# EAGLE schematic maplemini-r2 (EAGLE 5.10)
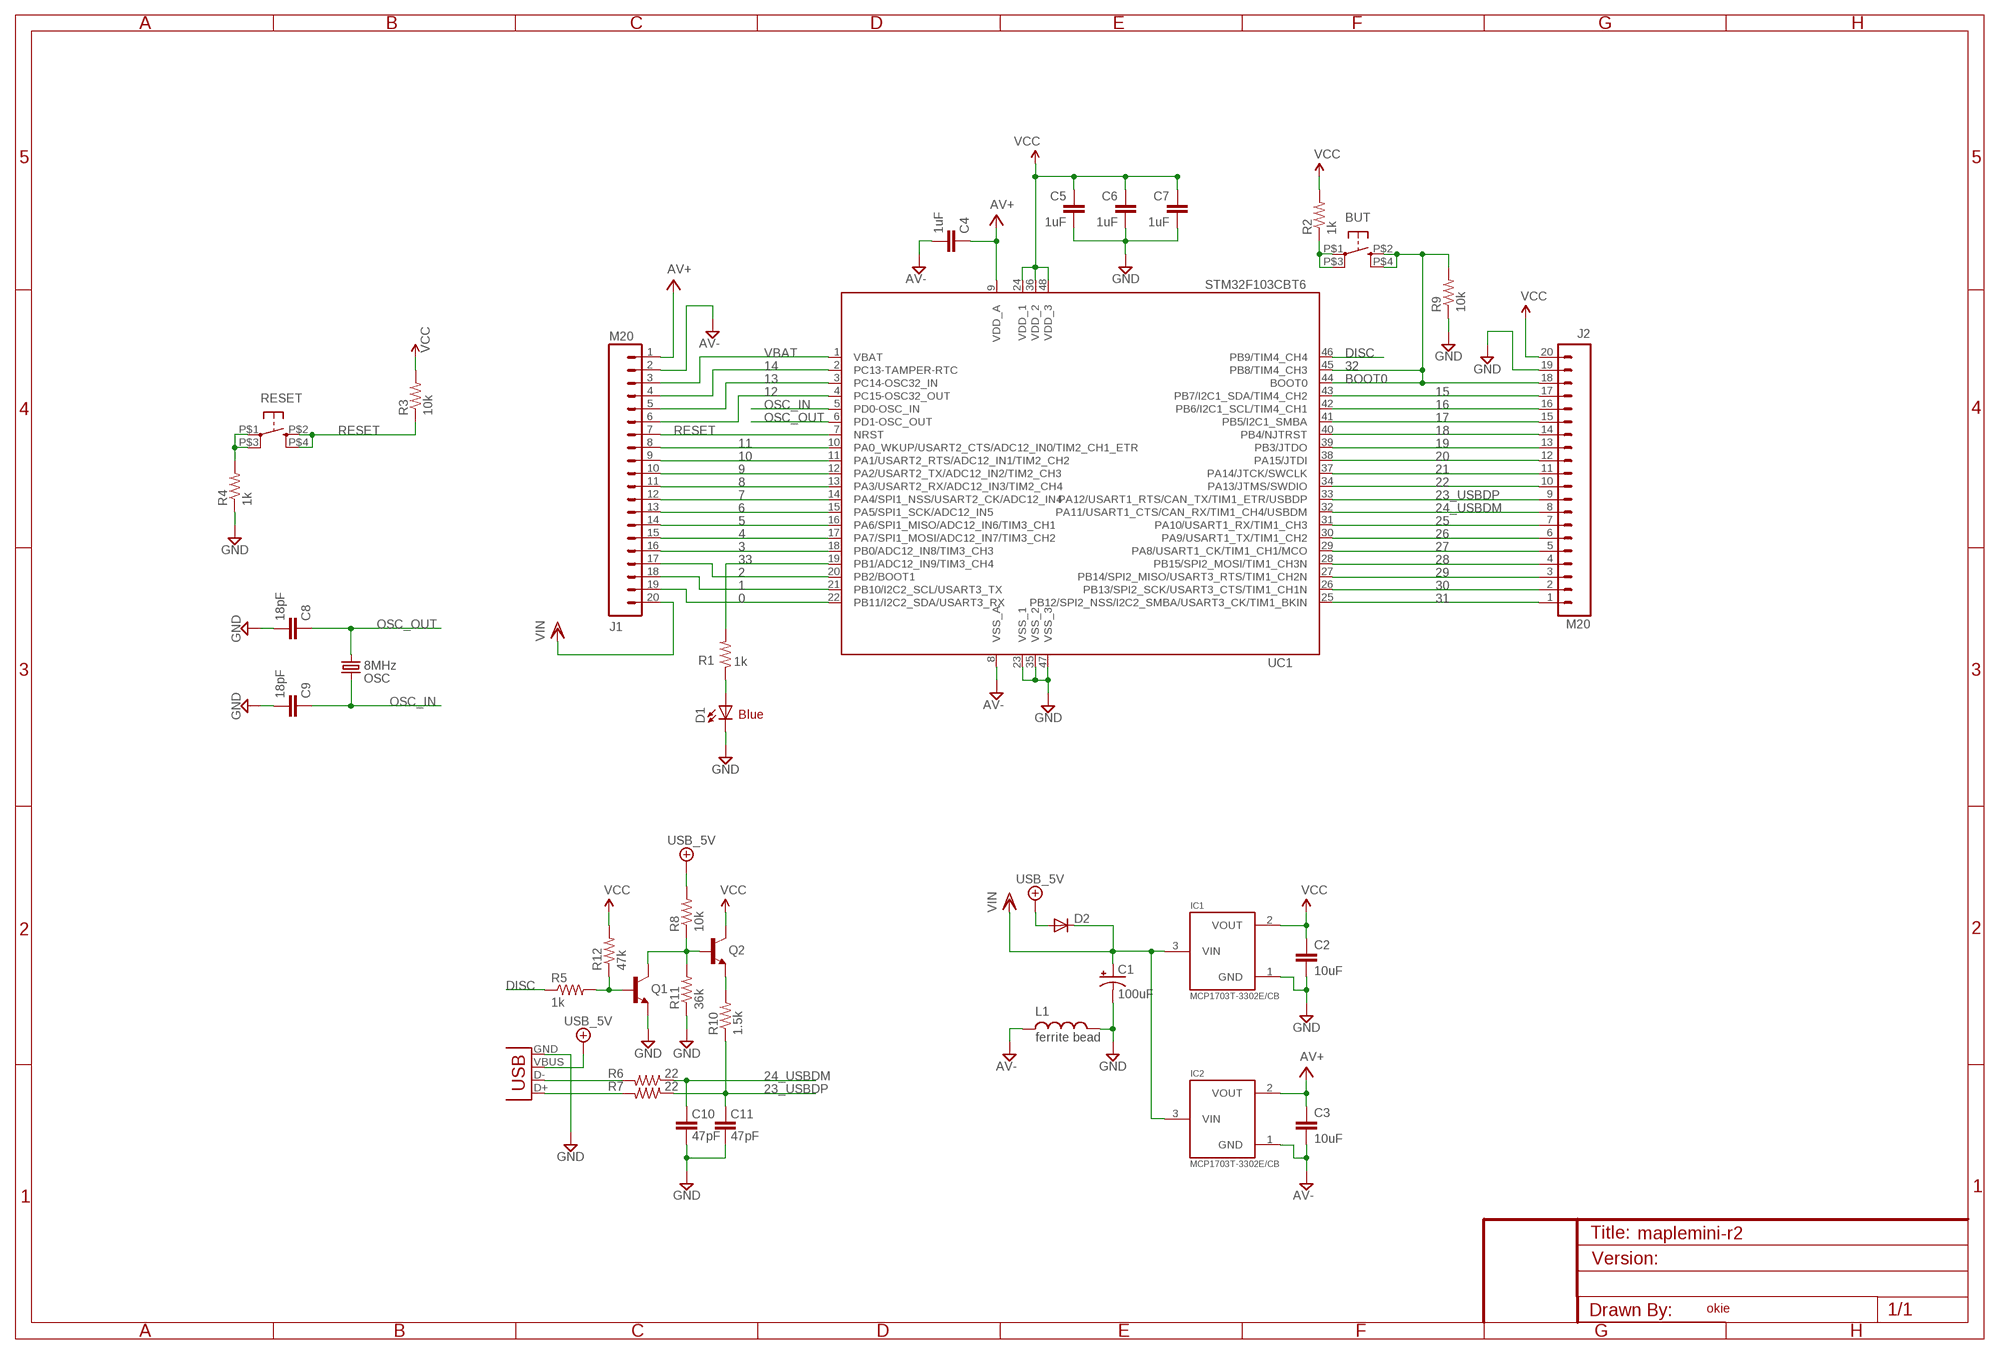
[diagram p0: schematic, sheet 1]

## Parts
BUT  KMR211GLFS  BUTTON-KMR241GLFS  [PUSHBUTTON-KMR241GLFS]
C1  100uF  CAP_POL1206  [EIA3216]
C2  10uF  CAP0805  [0805]
C3  10uF  CAP0805  [0805]
C4  1uF  CAP0402  [C0402]
C5  1uF  CAP0402  [C0402]
C6  1uF  CAP0402  [C0402]
C7  1uF  CAP0402  [C0402]
C8  18pF  CAP0402  [C0402]
C9  18pF  CAP0402  [C0402]
C10  47pF  CAP0402  [C0402]
C11  47pF  CAP0402  [C0402]
D1  Blue  LED1206  [LED-1206]
D2  DIODESOD  [SOD-323]
IC1  MCP1703T-3302E/CB  MCP1700T  [SOT23]
IC2  MCP1703T-3302E/CB  MCP1700T  [SOT23]
J1  M20  [1X20]
J2  M20  [1X20]
L1  ferrite bead  INDUCTOR0603  [0603]
OSC  8MHz  CRYSTAL5X3  [CRYSTAL-SMD-5X3]
Q1  NPN-BJT  TRANSISTOR_NPNSOT23  [SOT23]
Q2  NPN-BJT  TRANSISTOR_NPNSOT23  [SOT23]
R1  1k  RESISTOR0402  [C0402]
R2  1k  RESISTOR0402  [C0402]
R3  10k  RESISTOR0402  [C0402]
R4  1k  RESISTOR0402  [C0402]
R5  1k  RESISTOR0402  [C0402]
R6  22  RESISTOR0402  [C0402]
R7  22  RESISTOR0402  [C0402]
R8  10k  RESISTOR0402  [C0402]
R9  10k  RESISTOR0402  [C0402]
R10  1.5k  RESISTOR0402  [C0402]
R11  36k  RESISTOR0402  [C0402]
R12  47k  RESISTOR0402  [C0402]
RESET  KMR211GLFS  BUTTON-KMR241GLFS  [PUSHBUTTON-KMR241GLFS]
UC1  STM32F103CBT6  STM32F103CB  [LQFP48]
X1  USB-MINIB  USBSMD  [USB-MINIB]

## Nets
0: J1.19 UC1.22(PB11/I2C2_SDA/USART3_RX)
1: J1.18 UC1.21(PB10/I2C2_SCL/USART3_TX)
2: J1.17 UC1.20(PB2/BOOT1)
3: J1.16 UC1.18(PB0/ADC12_IN8/TIM3_CH3)
4: J1.15 UC1.17(PA7/SPI1_MOSI/ADC12_IN7/TIM3_CH2)
5: J1.14 UC1.16(PA6/SPI1_MISO/ADC12_IN6/TIM3_CH1)
6: J1.13 UC1.15(PA5/SPI1_SCK/ADC12_IN5)
7: J1.12 UC1.14(PA4/SPI1_NSS/USART2_CK/ADC12_IN4)
8: J1.11 UC1.13(PA3/USART2_RX/ADC12_IN3/TIM2_CH4)
9: J1.10 UC1.12(PA2/USART2_TX/ADC12_IN2/TIM2_CH3)
10: J1.9 UC1.11(PA1/USART2_RTS/ADC12_IN1/TIM2_CH2)
11: J1.8 UC1.10(PA0_WKUP/USART2_CTS/ADC12_IN0/TIM2_CH1_ETR)
12: J1.6 UC1.4(PC15-OSC32_OUT)
13: J1.5 UC1.3(PC14-OSC32_IN)
14: J1.4 UC1.2(PC13-TAMPER-RTC)
15: J2.17 UC1.43(PB7/I2C1_SDA/TIM4_CH2)
16: J2.16 UC1.42(PB6/I2C1_SCL/TIM4_CH1)
17: J2.15 UC1.41(PB5/I2C1_SMBA)
18: J2.14 UC1.40(PB4/NJTRST)
19: J2.13 UC1.39(PB3/JTDO)
20: J2.12 UC1.38(PA15/JTDI)
21: J2.11 UC1.37(PA14/JTCK/SWCLK)
22: J2.10 UC1.34(PA13/JTMS/SWDIO)
23_USBDP: C11.2 J2.9 R7.1 R10.1 UC1.33(PA12/USART1_RTS/CAN_TX/TIM1_ETR/USBDP)
24_USBDM: C10.2 J2.8 R6.1 UC1.32(PA11/USART1_CTS/CAN_RX/TIM1_CH4/USBDM)
25: J2.7 UC1.31(PA10/USART1_RX/TIM1_CH3)
26: J2.6 UC1.30(PA9/USART1_TX/TIM1_CH2)
27: J2.5 UC1.29(PA8/USART1_CK/TIM1_CH1/MCO)
28: J2.4 UC1.28(PB15/SPI2_MOSI/TIM1_CH3N)
29: J2.3 UC1.27(PB14/SPI2_MISO/USART3_RTS/TIM1_CH2N)
30: J2.2 UC1.26(PB13/SPI2_SCK/USART3_CTS/TIM1_CH1N)
31: J2.1 UC1.25(PB12/SPI2_NSS/I2C2_SMBA/USART3_CK/TIM1_BKIN)
32: BUT.P$2 BUT.P$4 J2.18 R9.2 UC1.44(BOOT0) UC1.45(PB8/TIM4_CH3)
33: R1.2 UC1.19(PB1/ADC12_IN9/TIM3_CH4)
+5V/2: D2.2(A) R8.2 X1.VBUS ; supply symbol labelled USB_5V
AV+: C3.1 C4.1 IC2.2(VOUT) J1.1 UC1.9(VDD_A)
AV-: C3.2 C4.2 IC2.1(GND) J1.2 L1.1 UC1.8(VSS_A)
DGND: C1.C(-) C2.2 C5.2 C6.2 C7.2 C8.2 C9.2 C10.1 C11.1 D1.C IC1.1(GND) J2.19 L1.2 Q1.2(E) R4.1 R9.1 R11.1 UC1.23(VSS_1) UC1.35(VSS_2) UC1.47(VSS_3) X1.GND ; supply symbol labelled GND
DISC: R5.1 UC1.46(PB9/TIM4_CH4)
N$1: BUT.P$1 BUT.P$3 R2.1
N$2: D1.A R1.1
N$4: R4.2 RESET.P$1 RESET.P$3
N$51: Q2.2(E) R10.2
N$59: R6.2 X1.D-
N$60: R7.2 X1.D+
N$71: Q1.3(C) Q2.1(B) R8.1 R11.2
N$73: Q1.1(B) R5.2 R12.1
OSC_IN: C9.1 OSC.3 UC1.5(PD0-OSC_IN)
OSC_OUT: C8.1 OSC.1 UC1.6(PD1-OSC_OUT)
RESET: J1.7 R3.1 RESET.P$2 RESET.P$4 UC1.7(NRST)
VBAT: J1.3 UC1.1(VBAT)
VCC: C2.1 C5.1 C6.1 C7.1 IC1.2(VOUT) J2.20 Q2.3(C) R2.2 R3.2 R12.2 UC1.24(VDD_1) UC1.36(VDD_2) UC1.48(VDD_3)
VIN: C1.A(+) D2.1(C) IC1.3(VIN) IC2.3(VIN) J1.20

## Notes on the sheet
- BOOT0
- Blue
- okie

## Library data of the parts
BUT RESET = okie:BUTTON-KMR241GLFS
C1 = SparkFun3:CAP_POL: Capacitor Polarized These are standard SMD and PTH capacitors. Normally 10uF, 47uF, and 100uF in electrolytic and tantalum varieties. Always verify the external diameter of the through hole cap, it varies with capacity, voltage, and manufacturer. The EIA devices should be standard.
C2 C3 = SparkFun2:CAP: Capacitor Standard 0603 ceramic capacitor, and 0.1" leaded capacitor.
C4-C11 = SparkFun:CAP: Capacitor Standard 0603 ceramic capacitor, and 0.1" leaded capacitor.
D1 = SparkFun:LED: LEDs Standard schematic elements and footprints for 5mm, 3mm, 1206, and 0603 sized LEDs. 5mm - Spark Fun Electronics SKU : COM-00529 (and others)
D2 = SparkFun3:DIODE: Diode These are standard reverse protection diodes and small signal diodes. SMA package can handle up to about 1A. SOD-323 can handle about 200mA. What the SOD-323 package when ordering, there are some mfgs out there that are 5-pin packages.
IC1 IC2 = okie:MCP1700T
J1 J2 = SparkFun3:M20: This is just like the LOCK variant in that the holes are staggared by 5 mil, but except for the last two holes. They are not altered from the "standard" footprint layout. This is used for a special purpose on the layout of our Graphic LCD Backpack. Make sure you want to use this device before selecting it for you project!
L1 = SparkFun3:INDUCTOR: Inductors Basic Inductor/Choke - 0603 and 1206. Footprints are not proven and vary greatly between part numbers.
OSC = SparkFun2:CRYSTAL: Crystals Various standard crystals. Proven footprints. Spark Fun Electronics SKU : COM-00534
Q1 Q2 = SparkFun2:TRANSISTOR_NPN: Transistor NPN BJT configuration in SOT23 package. MMBT2222 is the common NPN we use. Double check BCE configuration again layout.
R1-R12 = SparkFun:RESISTOR: Resistor Basic schematic elements and footprints for 0603, 1206, and PTH 1/10th watt (small) resistors.
UC1 = stm32:STM32F103CB
X1 = SparkFun2:USB: USB Connectors USB-B-PTH is fully proven SKU : PRT-00139 USB-miniB is fully proven SKU : PRT-00587 USB-A-PCB is untested. USB-A-H is throughly reviewed, but untested. Spark Fun Electronics SKU : PRT-00437 USB-B-SMT is throughly reviewed, but untested. Needs silkscreen touching up. USB-A-S has not been used/tested USB-MB-H has not been used/tested

## Net classes
1 vcc: width 0.254 mm